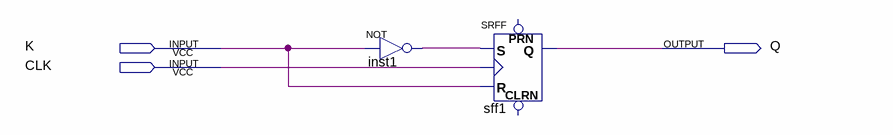
[diagram p0: schematic sheet]
// Quartus schematic debouncer.bdf as structural Verilog: 2 symbols, 3 pins
module debouncer (
  input  K,
  input  CLK,
  output Q
);

  wire inst1_out;

  not inst1 (inst1_out, K);
  SRFF sff1 (.S(inst1_out), .R(K), .CLK(CLK), .Q(Q));  // open: PRN, CLRN
endmodule
